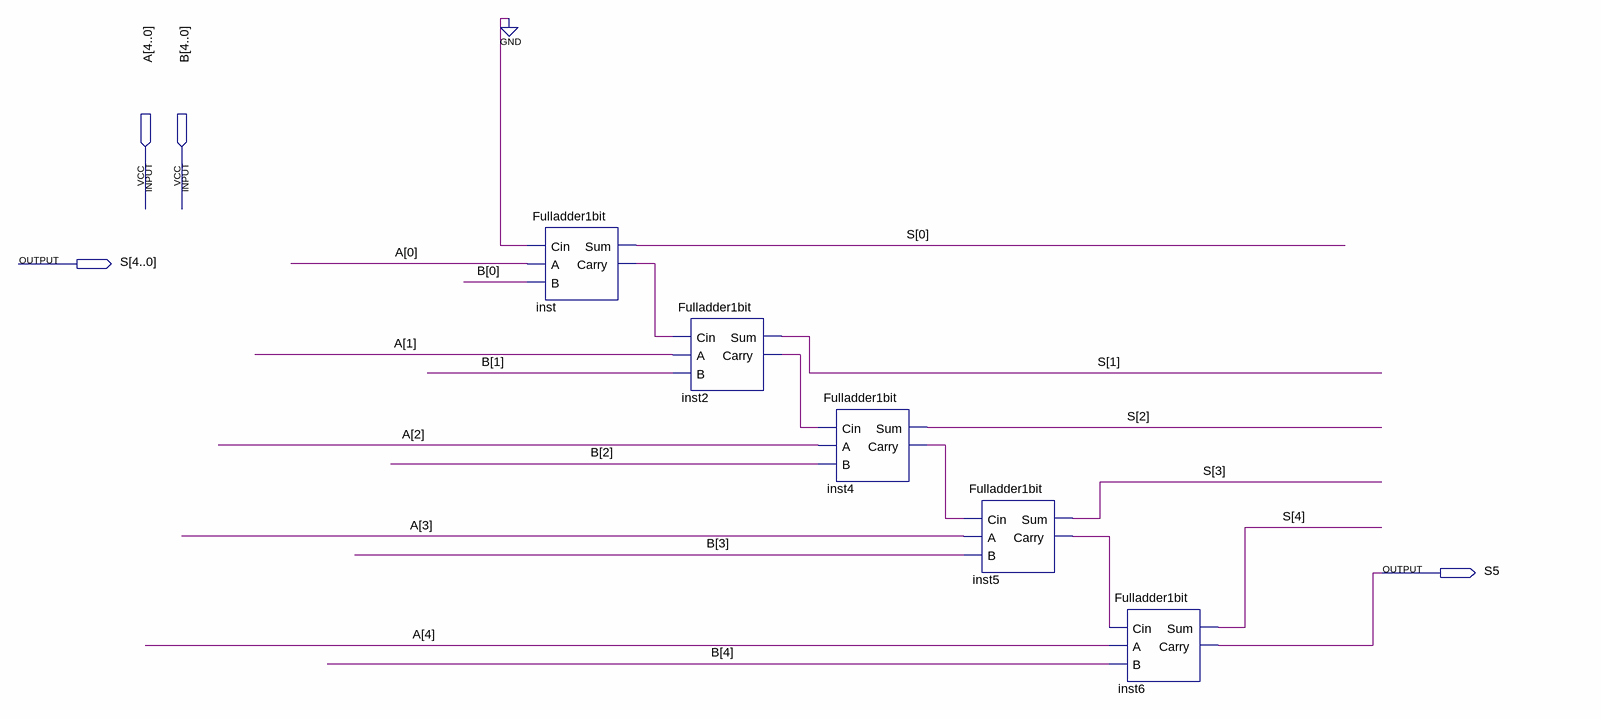
[diagram p0: schematic sheet]
// Quartus schematic Fulladder5bit.bdf as structural Verilog: 5 symbols, 4 pins
module Fulladder5bit (
  input  [4:0] A,
  input  [4:0] B,
  output [4:0] S,
  output S5
);

  wire inst2_carry, inst4_carry, inst5_carry, inst_carry;

  Fulladder1bit inst (.Cin(1'b0), .A(A[0]), .B(B[0]), .Sum(S[0]), .Carry(inst_carry));
  Fulladder1bit inst2 (.Cin(inst_carry), .A(A[1]), .B(B[1]), .Sum(S[1]), .Carry(inst2_carry));
  Fulladder1bit inst4 (.Cin(inst2_carry), .A(A[2]), .B(B[2]), .Sum(S[2]), .Carry(inst4_carry));
  Fulladder1bit inst5 (.Cin(inst4_carry), .A(A[3]), .B(B[3]), .Sum(S[3]), .Carry(inst5_carry));
  Fulladder1bit inst6 (.Cin(inst5_carry), .A(A[4]), .B(B[4]), .Sum(S[4]), .Carry(S5));
endmodule
